# Altium schematic sheet 04.SchDoc
size 420 x 297 mm
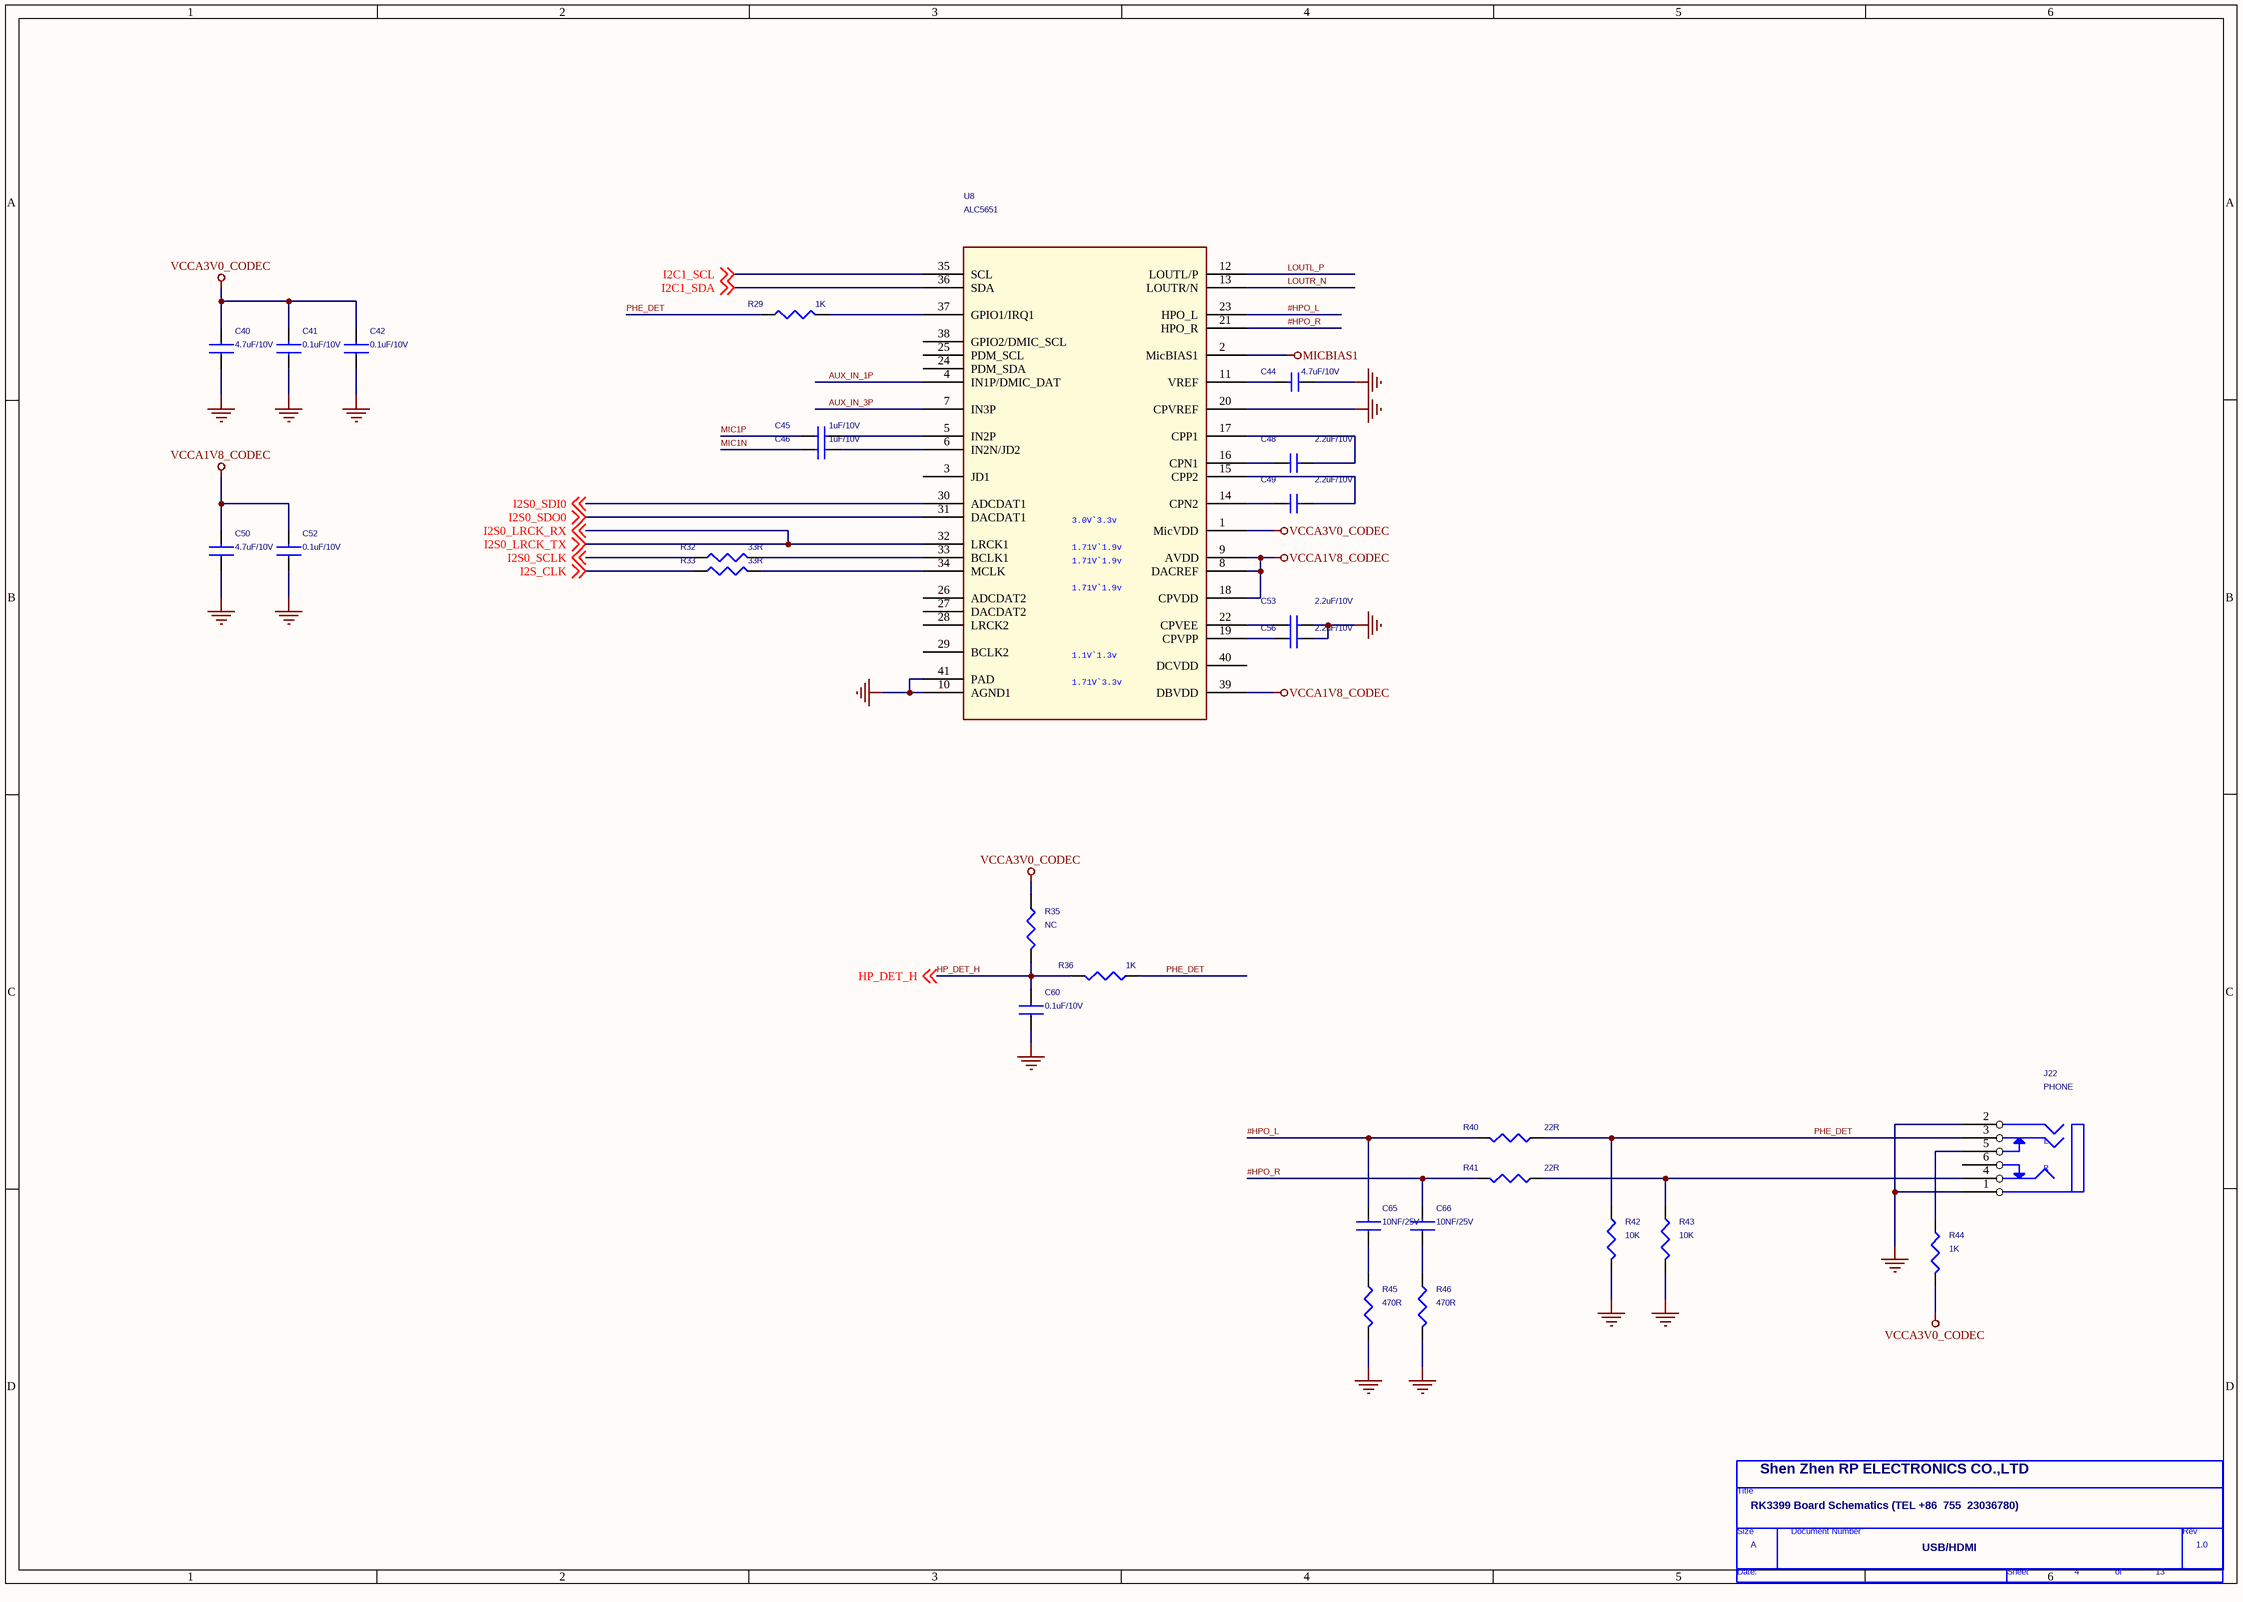
[diagram p0: 04.SchDoc]

## Parts
*  Doc: USB/HDMI  RevCode: 1.0  Title: RK3399 Board Schematics (TEL +86  755  23036780)  Page Size: A  Page Number: 4  Page Count: 13  Cage Code: Shen Zhen RP ELECTRONICS CO.,LTD  (hidden comment: TitleBlock0)  (graphical)
C40  4.7uF/10V  [0805C]
C41  0.1uF/10V  [0805C]
C42  0.1uF/10V  [0805C]
C44  4.7uF/10V  [0805C]
C45  1uF/10V  [0805C]
C46  1uF/10V  [0805C]
C48  2.2uF/10V  [0805C]
C49  2.2uF/10V  [0805C]
C50  4.7uF/10V  [0805C]
C52  0.1uF/10V  [0805C]
C53  2.2uF/10V  [0805C]
C56  2.2uF/10V  [0805C]
C60  0.1uF/10V  [0805C]
C65  10NF/25V  [0805C]
C66  10NF/25V  [0805C]
J22  PHONE  [PJ-3537]
R29  1K  [0805]
R32  33R  [0805]
R33  33R  [0805]
R35  NC  [0805]
R36  1K  [0805]
R40  22R  [0805]
R41  22R  [0805]
R42  10K  [0805]
R43  10K  [0805]
R44  1K  [0805]
R45  470R  [0805]
R46  470R  [0805]
U8  ALC5651  [QFN40-0.5]

## Nets
GND: C40.2 C41.2 C42.2 C44.1 C50.2 C52.2 C53.2 C56.2 C60.2 J22.1(E) J22.2 R42.2 R43.2 R45.2 R46.2 U8.10(AGND1) U8.20(CPVREF) U8.41(PAD)
MICBIAS1: U8.2(MicBIAS1)
VCCA1V8_CODEC: C50.1 C52.1 U8.8(DACREF) U8.9(AVDD) U8.18(CPVDD) U8.39(DBVDD)
VCCA3V0_CODEC: C40.1 C41.1 C42.1 R35.1 R44.2 U8.1(MicVDD)
#HPO_L: C65.2 R40.2 U8.23(HPO_L)
#HPO_R: C66.2 R41.2 U8.21(HPO_R)
AUX_IN_1P: U8.4(IN1P/DMIC_DAT)
AUX_IN_3P: U8.7(IN3P)
HP_DET_H: C60.1 R35.2 R36.2 ; off-sheet HP_DET_H
I2C1_SCL: U8.35(SCL) ; off-sheet I2C1_SCL
I2C1_SDA: U8.36(SDA) ; off-sheet I2C1_SDA
I2S0_LRCK_RX: U8.32(LRCK1) ; off-sheet I2S0_LRCK_TX, off-sheet I2S0_LRCK_RX  [also labelled I2S0_LRCK_TX]
I2S0_SCLK: R32.1 ; off-sheet I2S0_SCLK
I2S0_SDI0: U8.30(ADCDAT1) ; off-sheet I2S0_SDI0
I2S0_SDO0: U8.31(DACDAT1) ; off-sheet I2S0_SDO0
I2S_CLK: R33.1 ; off-sheet I2S_CLK
LOUTL_P: U8.12(LOUTL/P)
LOUTR_N: U8.13(LOUTR/N)
MIC1N: C46.1
MIC1P: C45.1
PHE_DET: J22.3(A) R29.1 R36.1 R40.1 R42.1
NetC44_2: C44.2 U8.11(VREF)
NetC45_2: C45.2 U8.5(IN2P)
NetC46_2: C46.2 U8.6(IN2N/JD2)
NetC48_1: C48.1 U8.16(CPN1)
NetC48_2: C48.2 U8.17(CPP1)
NetC49_1: C49.1 U8.14(CPN2)
NetC49_2: C49.2 U8.15(CPP2)
NetC53_1: C53.1 U8.22(CPVEE)
NetC56_1: C56.1 U8.19(CPVPP)
NetC65_1: C65.1 R45.1
NetC66_1: C66.1 R46.1
NetJ22_4: J22.4(D) R41.1 R43.1
NetJ22_5: J22.5(B) R44.1
NetR29_2: R29.2 U8.37(GPIO1/IRQ1)
NetR32_2: R32.2 U8.33(BCLK1)
NetR33_2: R33.2 U8.34(MCLK)

Not connected (* = marked no-connect by the designer): J22 6(C); U8 3(JD1) 24(PDM_SDA) 25(PDM_SCL) 26(ADCDAT2) 27(DACDAT2) 28(LRCK2) 29(BCLK2) 38(GPIO2/DMIC_SCL) 40(DCVDD)

## Notes on the sheet
- (in symbol ALC5651_3) 3.0V`3.3v; 1.71V`1.9v; 1.1V`1.3v; 1.71V`3.3v
- (in symbol PHONEJACK STEREO SW_2) L; R
- (in symbol TitleBlock0) Title; Size; Document Number; Rev; Date:; Sheet; of

## Library data of the parts
C40-C42 C50 C52 C60 = CAP NP_Dup6: RoHS CHIP CAP 0.1uF +10/-10% X7R
C44 = SMALL CAP: CAP,MLCC,4.7uF,+/-10%,X5R,6.3V,SMD0603
C45 C46 = SMALL CAP: CAP,MLCC,1uF,+/-10%,X5R,6.3V,SMD0402
C48 C49 C53 C56 = SMALL CAP: CAP,MLCC,2.2uF,+/-10%,X5R,6.3V,SMD0603; Supplier: MURATA; Supplier P/N: GRM188R61C225KE15
C65 C66 = CAP NP_Dup6: RoHS CHIP CAP 0.47uF +10/-10% X5R
J22 = PHONEJACK STEREO SW_2
R29 R32 R33 = RESISTOR: ROHS CHIP RES 33R 1/16W 5%
R35 = RESISTOR: ROHS CHIP RES 1K 1/16W 5%; Option: DNP
R36 = RESISTOR: ROHS CHIP RES 1K 1/16W 5%
R40 R41 = RES 1B: ROHS CHIP RES 22Ohm 1/16W +/-5%
R42-R46 = RES 1B: ROHS CHIP RES 470Ohm 1/16W +/-5%
U8 = ALC5651_3
* = TitleBlock0: Page Create Date: March  8, 1995